# EAGLE design BTstackLE-Shield_v_1_0 (EAGLE 6.5.0)
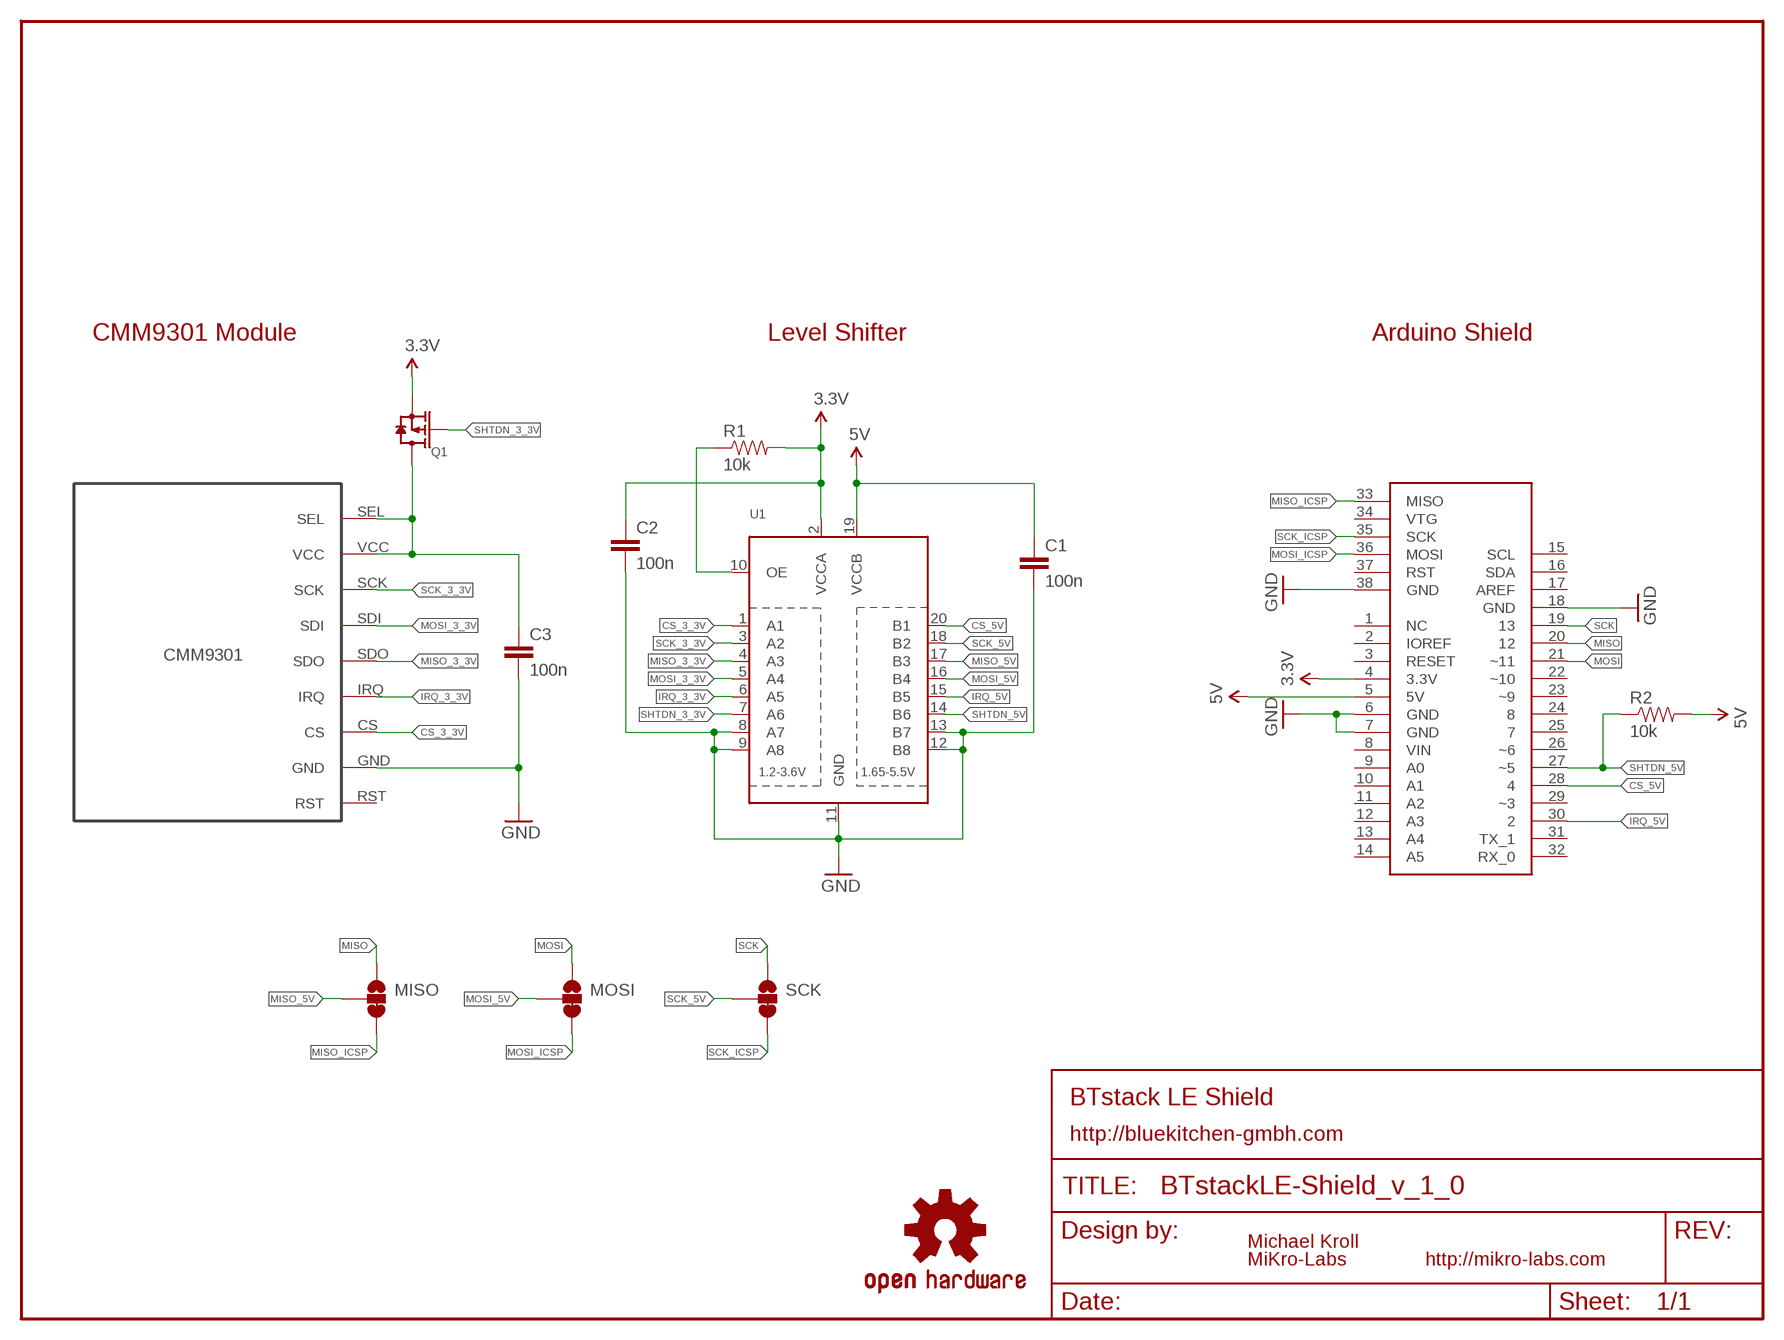
[diagram p0: schematic, sheet 1]

## Parts
C1  100n  CAP0603-CAP  [0603-CAP]
C2  100n  CAP0603-CAP  [0603-CAP]
C3  100n  CAP0603-CAP  [0603-CAP]
FRAME1  FRAME-LETTER  [CREATIVE_COMMONS]
LOGO1  OSHW-LOGOL  [OSHW-LOGO-L]
MISO  JUMPER-PAD-3-2OF3_NC_BY_TRACE_SMALL  [PAD-JUMPER-3-2OF3_NC_BY_TRACE_YES_SILK_FULL_BOX]
MOSI  JUMPER-PAD-3-2OF3_NC_BY_TRACE_SMALL  [PAD-JUMPER-3-2OF3_NC_BY_TRACE_YES_SILK_FULL_BOX]
Q1  MOSFET-P-0440210P1  [SOT23]
R1  10k  RESISTOR0603-RES  [0603-RES]
R2  10k  RESISTOR0603-RES  [0603-RES]
SCK  JUMPER-PAD-3-2OF3_NC_BY_TRACE_SMALL  [PAD-JUMPER-3-2OF3_NC_BY_TRACE_YES_SILK_FULL_BOX]
U1  TXB0108PWR  [TSSOP20]
U$1  ARDUINO_UNO_SHIELD_ICSP_PADS_ONLY  [ICSP_PADS_ONLY]
U$4  CMM9301  [CMM9301]

## Nets
3.3V: C2.1 Q1.2(S) R1.2 U1.2(VCCA) U$1.4(3.3V)
5V: C1.1 R2.2 U1.19(VCCB) U$1.5(5V)
CS_3_3V: U1.1(A1) U$4.CS
CS_5V: U1.20(B1) U$1.28
GND: C1.2 C2.2 C3.2 U1.8(A7) U1.9(A8) U1.11(GND) U1.12(B8) U1.13(B7) U$1.6(GND) U$1.7(GND) U$1.18(GND) U$1.38(GND) U$4.GND
IRQ_3_3V: U1.6(A5) U$4.IRQ
IRQ_5V: U1.15(B5) U$1.30
MISO: MISO.1 U$1.20
MISO_3_3V: U1.4(A3) U$4.SDO
MISO_5V: MISO.2 U1.17(B3)
MISO_ICSP: MISO.3 U$1.33(MISO)
MOSI: MOSI.1 U$1.21(~11)
MOSI_3_3V: U1.5(A4) U$4.SDI
MOSI_5V: MOSI.2 U1.16(B4)
MOSI_ICSP: MOSI.3 U$1.36(MOSI)
N$1: C3.1 Q1.3(D) U$4.SEL U$4.VCC
N$6: R1.1 U1.10(OE)
SCK: SCK.1 U$1.19
SCK_3_3V: U1.3(A2) U$4.SCK
SCK_5V: SCK.2 U1.18(B2)
SCK_ICSP: SCK.3 U$1.35(SCK)
SHTDN_3_3V: Q1.1(G) U1.7(A6)
SHTDN_5V: R2.1 U1.14(B6) U$1.27(~5)
Unconnected: U$1.1(NC) U$1.2(IOREF) U$1.3(RESET) U$1.8(VIN) U$1.9(A0) U$1.10(A1) U$1.11(A2) U$1.12(A3) U$1.13(A4) U$1.14(A5) U$1.15(SCL) U$1.16(SDA) U$1.17(AREF) U$1.22(~10) U$1.23(~9) U$1.24 U$1.25 U$1.26(~6) U$1.29(~3) U$1.31(TX_1) U$1.32(RX_0) U$1.34(VTG) U$1.37(RST) U$4.RST

## Notes on the sheet
- CMM9301 Module | Level Shifter | Arduino Shield
- BTstack LE Shield
- http://bluekitchen-gmbh.com
- Michael Kroll
- MiKro-Labs | http://mikro-labs.com

## Library data of the parts
C1-C3 = SparkFun-Capacitors:CAP: Capacitor Standard 0603 ceramic capacitor, and 0.1" leaded capacitor.
FRAME1 = SparkFun-Aesthetics:FRAME-LETTER: Schematic Frame Standard 8.5x11 US Letter frame
LOGO1 = SparkFun-Aesthetics:OSHW-LOGO: Open Source Hardware Logo This logo indicates the piece of hardware it is found on incorporates a OSHW license and/or adheres to the definition of open source hardware found here: http://freedomdefined.org/OSHW
MISO MOSI SCK = SparkFun-Passives:JUMPER-PAD-3-2OF3_NC_BY_TRACE
Q1 = OPL:MOSFET-P: CJ2305：SMD MOSFET P-CH 8V-4.1A
R1 R2 = SparkFun-Resistors:RESISTOR: Resistor Basic schematic elements and footprints for 0603, 1206, and PTH resistors.
U1 = adafruit:TXB0108PWR: 8-Bit Bi-Directional Level Shifter 1.2V-3.6V (VCCA) to 1.65V-5.5V (VCCB) bi-directional level shifter with auto direction sensing. Max data rate - VCCA 1.8V: 20Mbps (50ns), VCCA 3.3V: 100Mbps (10ns) Digikey: 296-21527-1-ND
U$1 = Arduino_Shields:ARDUINO_UNO_SHIELD_ICSP: Arduino Uno R3 Shield with ICSP header.
U$4 = Bluetooth:CMM9301

## Board
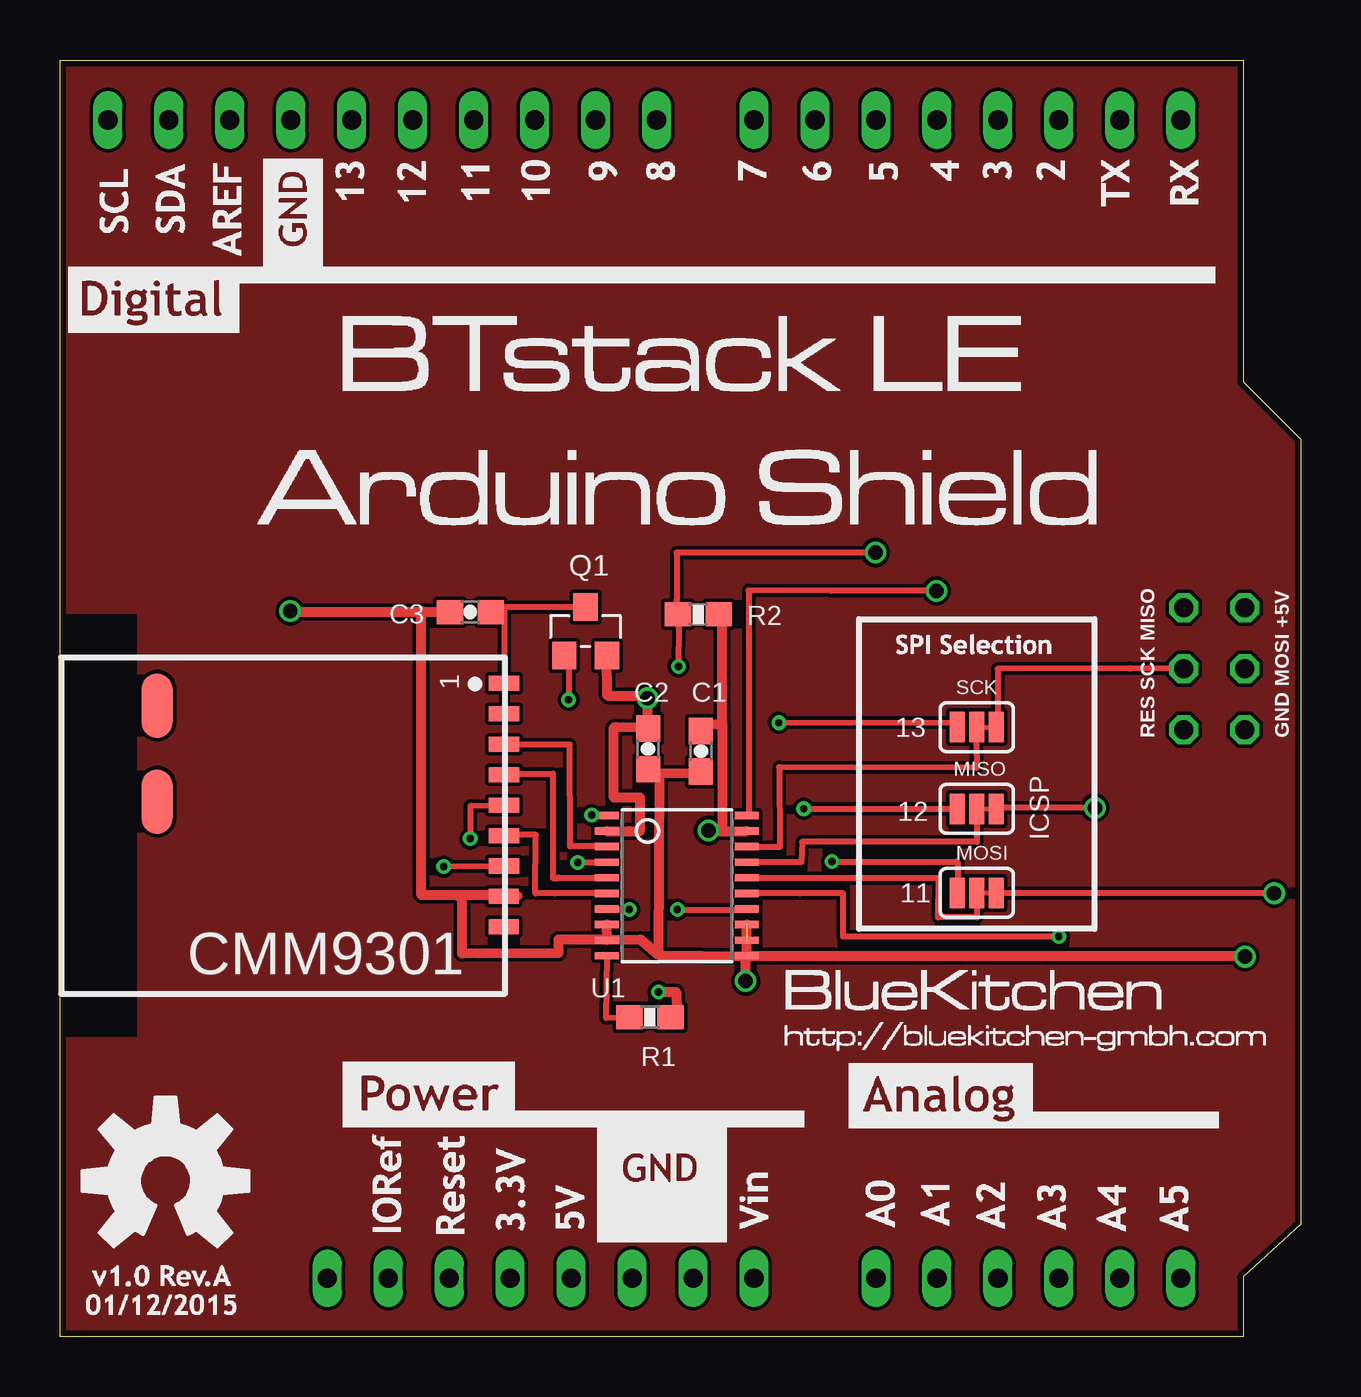
[diagram p1: board, top side]
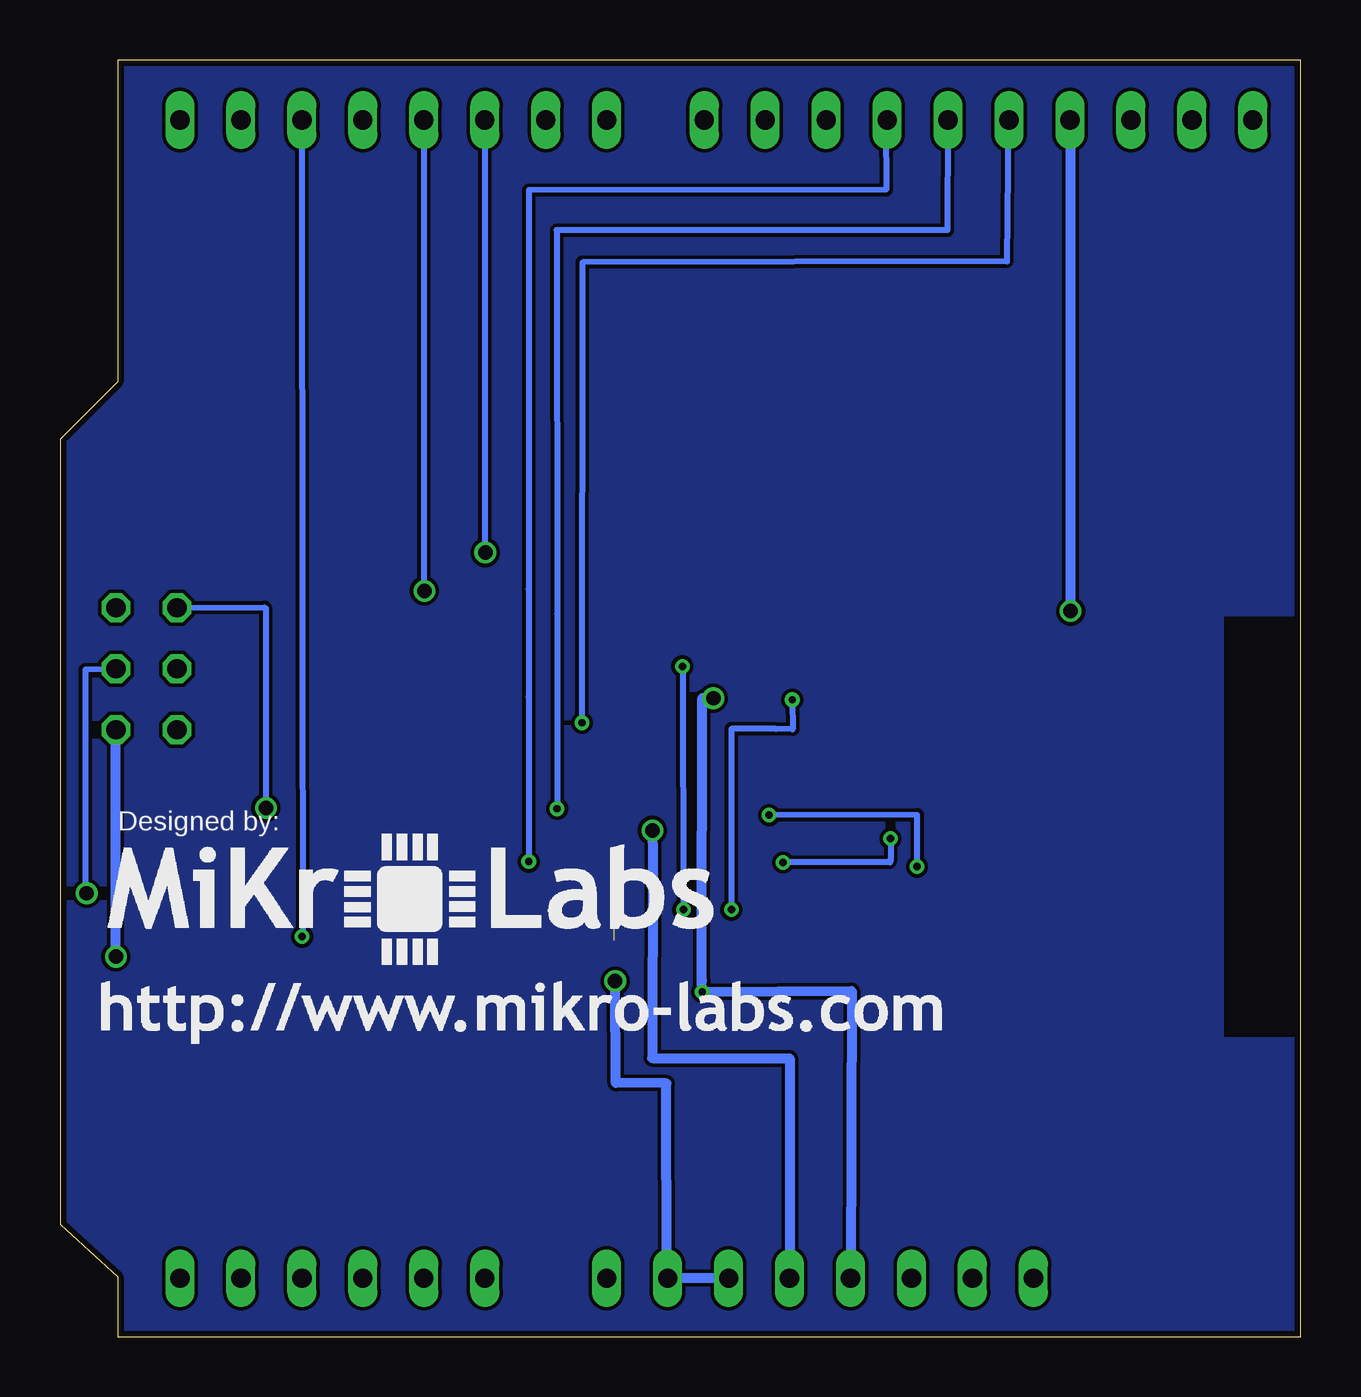
[diagram p2: board, bottom side, seen from below]

Size 51.7 x 53.2 mm. Coordinates in mm from the lower left corner, seen from the top.
Outline: 0,53.2 49.3,53.2 49.3,39.8 51.7,37.4 51.7,4.7 49.3,2.5 49.3,0 0,0 0,53.2
Copper layers (1*2*15*16): Top 0.035mm / dielectric 0.2mm / layer 2 0.0175mm / dielectric 1.1mm / layer 15 0.0175mm / dielectric 0.2mm / Bottom 0.035mm
Design rules "SeeedStudio_DRU_no_angle_20130527": minimum track width 6mil, minimum drill 12mil, track to track 6mil, track to pad 6mil, pad to pad 6mil, via to via 6mil, smd to smd 0mil, copper to edge 10mil, drill to drill 10mil, minimum pad ring 6mil, minimum via ring 6mil, stop-mask expansion 2mil, vias tented up to drill 25mil, thermal gap 10mil
tRestrict: area 0,12.5 to 3.2,30.1
bRestrict: area -0.1,12.5 to 3.2,30

### Footprints (pad centres in the part's own frame; a part is rotated, then mirrored left to right if it is on the bottom)
0603-CAP = smd 1.1 x 1: 1 -0.85,0; 2 0.85,0
PAD-JUMPER-3-2OF3_NC_BY_TRACE_YES_SILK_FULL_BOX = smd 0.635 x 1.27: 1 -0.813,0; 2 0,0; 3 0.813,0
SOT23 = smd 1.016 x 1.143: 1 -0.889,-1.016; 2 0.889,-1.016; 3 0,1.016
0603-RES = smd 1.1 x 1: 1 -0.85,0; 2 0.85,0
TSSOP20 = smd 0.305 x 0.991: 1 -2.925,-2.918; 2 -2.275,-2.918; 3 -1.625,-2.918; 4 -0.975,-2.918; 5 -0.325,-2.918; 6 0.325,-2.918; 7 0.975,-2.918; 8 1.625,-2.918; 9 2.275,-2.918; 10 2.925,-2.918; 11 2.925,2.918; 12 2.275,2.918; 13 1.625,2.918; 14 0.975,2.918; 15 0.325,2.918; 16 -0.325,2.918; 17 -0.975,2.918; 18 -1.625,2.918; 19 -2.275,2.918; 20 -2.925,2.918
ICSP_PADS_ONLY = drill 0.8 long: 1 27.94,2.54; 2 30.48,2.54; 3 33.02,2.54; 4 35.56,2.54; 5 38.1,2.54; 6 40.64,2.54; 7 43.18,2.54; 8 45.72,2.54; 9 50.8,2.54; 10 53.34,2.54; 11 55.88,2.54; 12 58.42,2.54; 13 60.96,2.54; 14 63.5,2.54; 15 18.796,50.8; 16 21.336,50.8; 17 23.876,50.8; 18 26.416,50.8; 19 28.956,50.8; 20 31.496,50.8; 21 34.036,50.8; 22 36.576,50.8; 23 39.116,50.8; 24 41.656,50.8; 25 45.72,50.8; 26 48.26,50.8; 27 50.8,50.8; 28 53.34,50.8; 29 55.88,50.8; 30 58.42,50.8; 31 60.96,50.8; 32 63.5,50.8 | drill 0.8 octagon: 33 63.627,30.48; 34 66.167,30.48; 35 63.627,27.94; 36 66.167,27.94; 37 63.627,25.4; 38 66.167,25.4
CMM9301 = smd 1.27 x 0.635: CS 9.207,-1.688; GND 9.19,-2.94; IRQ 9.207,-0.417; RST 9.19,-4.21; SCK 9.207,3.393; SDI 9.207,2.123; SDO 9.207,0.853; SEL 9.207,5.933; VCC 9.207,4.662 | smd 1.3 x 2.7: NC1 -5.25,5; NC2 -5.25,1

### Placement (x,y rotation side)
C1  26.7,24.4 270 top
C2  24.5,24.5 270 top
C3  17.1,30.2 180 top
FRAME1  -12.77,32.88 0 top  (outside the outline)
LOGO1  4.4,6.5 0 top
MISO  38.2,22 0 top
MOSI  38.2,18.5 0 top
Q1  21.9,29.4 0 top
R1  24.58,13.32 0 top
R2  26.6,30.1 0 top
SCK  38.2,25.4 0 top
U1  25.7,18.8 270 top
U$1  -16.8,-0.1 0 top
U$2  [DIGITAL]  0.3,41.8 0 top
U$3  [POWER-ANALOG]  12,4.1 0 top
U$4  9.3,21.3 0 top
U$5  [BLUE-KITCHEN-LOGO]  30.12,13.45 0 top
U$6  [SPI-SELECTION]  34.4,28 0 top
U$7  [BTSTACK-LE-SHIELD-TEXT]  7.99,33.67 0 top
U$8  [BLUEKITCHEN-LINK]  30.09,11.77 0 top
U$9  [MIKROLABS-LOGO]  50,14.9 0 bottom
U$10  [MIKROLABS-URL]  50.4,11.7 0 bottom
U$11  [V1_0_01_12_2015]  0.93,0.8 0 top

### Tracks (layer width: path | path; a pad name or v marks a point on that pad's centre or on a via)
3.3V  (via drill 0.3, 0.6)
  Top 0.406: 24.51,25.39 24.48,25.37 v24.48,26.61 24.48,26.7 22.84,26.7 22.8,26.73 Q1.2 | U1.2 23.72,21.07 24.17,21.07 24.17,22.47 23.08,22.47 23.08,25.39 23.16,25.41 24.51,25.39 | 24.51,25.39 C2.1 | v24.94,14.37 25.67,14.37 25.67,14.36 25.7,13.59 R1.2
  Bottom 0.406: v24.48,26.61 24.93,26.61 24.96,15.53 24.96,14.85 v24.94,14.37 18.71,14.41 U$1.4
5V  (via drill 0.6)
  Top 0.152: 26.9,25.56 C1.1 | 27.6,30.05 R2.2
  Top 0.254: 27.6,21.1 27.58,21.07 | U1.19
  Top 0.406: 26.9,25.56 27.6,25.51 | 27.6,25.51 27.6,30.05 | 27.6,25.51 27.6,21.1 | U1.19 27.58,21.07 27.53,21.04 v27.02,21.1
  Bottom 0.406: v27.02,21.1 26.99,20.04 27.03,11.61 21.3,11.6 U$1.5
CS_3_3V  (via drill 0.3)
  Top 0.152: 18.62,19.6 18.8,19.6 U$4.CS | 22.45,21.72 U1.1
  Top 0.254: v22.16,21.74 22.14,21.76 22.14,21.73 22.42,21.72 22.45,21.72 | 18.62,19.6 v15.99,19.59
  Bottom 0.254: v22.16,21.74 15.99,21.75 v15.99,19.59
CS_5V  (via drill 0.6)
  Top 0.254: v36.52,31.08 32.12,31.08 28.69,31.1 28.69,21.8 U1.20
  Bottom 0.254: U$1.28 36.54,31.1 v36.52,31.08
GND  (via drill 0.6)  (1 unrouted)
  Top 0.152: 26.6,23.5 C1.2 | 22.8,16.54 22.6,16.54 | 22.68,16.57 U1.9 | 16.17,30.1 C3.2 | 18.2,18.4 U$4.GND 18.5,18.4 | 24.98,23.47 C2.2
  Top 0.406: 26.6,23.5 24.98,23.47 24.96,15.9 | 22.68,16.57 22.6,16.54 20.77,16.54 20.77,15.99 16.76,15.96 16.76,18.22 16.58,18.4 | 18.2,18.4 16.58,18.4 | 16.58,18.4 15.06,18.4 15.05,28.31 15.05,30.06 15.13,30.21 C3.2 9.63,30.2 v9.59,30.24 | 18.5,18.4 19.07,18.38 | 24.96,15.9 24.18,16.56 22.8,16.54 U1.8 | 24.96,15.9 28.65,15.85 U1.11 | U1.11 U1.13 | v49.37,15.84 49.36,15.85 28.78,15.85 U1.11 | v28.57,14.82 28.57,15.82 U1.11
  Bottom 0.406: v9.59,30.24 9.59,50.68 U$1.18 | v49.37,15.84 49.37,25.15 U$1.38 | U$1.7 U$1.6 26.34,2.44 26.41,2.5 26.43,10.55 28.54,10.58 v28.57,14.82
IRQ_3_3V
  Top 0.152: 22.5,18.48 U1.6
  Top 0.254: 22.76,18.45 U1.6 | 22.5,18.48 20.62,18.48 19.8,18.48 19.83,20.92 19.11,20.92 U$4.IRQ
IRQ_5V  (via drill 0.3)
  Top 0.152: 28.7,18.48 U1.15
  Top 0.254: v41.61,16.67 32.63,16.68 32.63,18.48 30.83,18.48 28.7,18.48
  Bottom 0.254: v41.61,16.67 41.59,16.65 41.61,28.98 41.63,49.97 41.6,50.5 U$1.30
MISO  (via drill 0.3)
  Top 0.254: v30.99,22 MISO.1
  Bottom 0.254: v30.99,22 30.99,22.02 30.98,30.14 30.99,30.14 31.01,46.12 14.73,46.11 14.7,50.57 14.62,50.63 U$1.20
MISO_3_3V  (via drill 0.3)
  Top 0.152: 22.75,19.8 U1.4 | 18.52,22.13 U$4.SDO
  Top 0.254: 22.75,19.8 22.43,19.77 21.67,19.77 v21.57,19.76 | 18.52,22.13 17.19,22.11 17.09,22.12 v17.09,20.76
  Bottom 0.254: v17.09,20.76 17.09,19.9 17.13,19.76 v21.57,19.76
MISO_5V
  Top 0.152: 38.2,21.96 38.3,22 MISO.2 | 28.75,19.77 U1.17
  Top 0.254: 28.75,19.77 30.89,19.77 30.92,20.62 38.2,20.62 38.2,21.96
MISO_ICSP  (via drill 0.6)
  Top 0.254: v43.12,22.04 39.05,22.04 MISO.3
  Bottom 0.254: U$1.33 46.82,30.38 43.17,30.39 43.12,30.34 43.12,26.68 v43.12,22.04
MOSI  (via drill 0.3)
  Top 0.152: 37.4,18.7 MOSI.1
  Top 0.254: v32.17,19.8 37.36,19.8 37.41,19.75 37.4,18.7
  Bottom 0.254: v32.17,19.8 32.17,19.87 32.17,26.65 32.17,26.68 32.17,31.15 32.16,47.78 17.27,47.8 17.3,50.5 U$1.21
MOSI_3_3V
  Top 0.152: 22.3,19.13 22.7,19.1 U1.5 | 19.08,23.45 U$4.SDI
  Top 0.254: 22.3,19.13 20.77,19.13 20.75,19.11 20.54,19.11 20.54,23.47 19.08,23.45
MOSI_5V
  Top 0.152: 38,18.4 38.2,17.82 | 28.78,19.1 U1.16
  Top 0.254: 28.78,19.1 36.62,19.1 36.59,17.47 38.21,17.47 38.2,17.82 | 38,18.4 MOSI.2
MOSI_ICSP  (via drill 0.6)
  Top 0.254: v50.59,18.48 39.03,18.48 MOSI.3
  Bottom 0.254: U$1.36 49.37,27.8 50.64,27.8 50.64,18.48 v50.59,18.48
N$1
  Top 0.152: U$4.VCC 18.5,26.2 18.5,27.1 U$4.SEL 18.5,27.4 | 18.5,30.4 18.2,30.4 C3.1 | 21.8,30.4 Q1.3
  Top 0.254: 21.8,30.4 18.5,30.4 18.5,27.4
N$2
  pour Bottom: 0,53.2 49.3,53.2 49.3,39.8 51.7,37.4 51.7,4.7 49.3,2.3 49.3,0 0,0
N$3
  pour Top: 0,53.2 49.3,53.2 49.3,39.8 51.7,37.4 51.7,4.7 49.3,2.3 49.3,0 0,0
N$6
  Top 0.152: 22.77,15.85 U1.10
  Top 0.254: 22.77,15.85 22.75,13.29 R1.1
SCK  (via drill 0.3)
  Top 0.152: 37.1,25.6 SCK.1
  Top 0.254: v29.95,25.59 37.1,25.6
  Bottom 0.152: 12.2,50.5 U$1.19
  Bottom 0.254: 12.2,50.5 12.25,44.8 29.94,44.77 v29.95,25.59
SCK_3_3V
  Top 0.152: 22.89,20.45 23,20.5 U1.3
  Top 0.254: U1.3 22.33,20.43 22.32,20.44 21.25,20.44 21.24,24.68 19.09,24.68 19.09,24.69 U$4.SCK
SCK_5V
  Top 0.152: 38.18,24.72 38.18,25.45 SCK.2 | 28.83,20.4 U1.18
  Top 0.254: 28.83,20.4 29.99,20.4 29.96,23.74 38.19,23.71 38.18,24.72
SCK_ICSP
  Top 0.152: 39.07,25.4 SCK.3
  Top 0.254: 39.07,25.4 39.07,27.84 44.57,27.85 44.6,27.85 46.8,27.83 46.83,27.82 U$1.35
SHTDN_3_3V  (via drill 0.3)
  Top 0.152: 23,17.8 U1.7 | 21.2,28.3 Q1.1
  Top 0.254: v23.72,17.8 23,17.8 | v21.19,26.54 21.2,27.7 21.2,28.3
  Bottom 0.254: v23.72,17.8 23.72,25.33 21.87,25.33 21.18,25.31 v21.19,26.54
SHTDN_5V  (via drill 0.3, 0.6)
  Top 0.152: 28.4,17.8 U1.14 | 25.7,30.1 R2.1
  Top 0.254: v25.72,17.8 28.4,17.8 | v25.77,27.93 25.78,29.58 25.7,30.1 25.7,30.7 | 25.7,30.7 | v33.98,32.68 25.7,32.68 25.7,32.57 25.7,30.7
  Bottom 0.254: v25.72,17.8 25.75,27.95 v25.77,27.93 | U$1.27 34,32.7
  Bottom 0.406: 34,32.7 v33.98,32.68

### Text on the board
tNames: RES SCK MISO | GND MOSI +5V | 13 | 12 | ICSP | 11
bNames: Designed by: